# Altium project Altium_project_DPRS10A16V.PrjPcb (part 2 of 2)

## Sheet Buck.SchDoc
size A3; SheetNumber: 2; SheetTotal: 2
Used 2 times, as channels U_Buck, U_Buck. Parts and nets are listed once, with the designators drawn on the sheet.
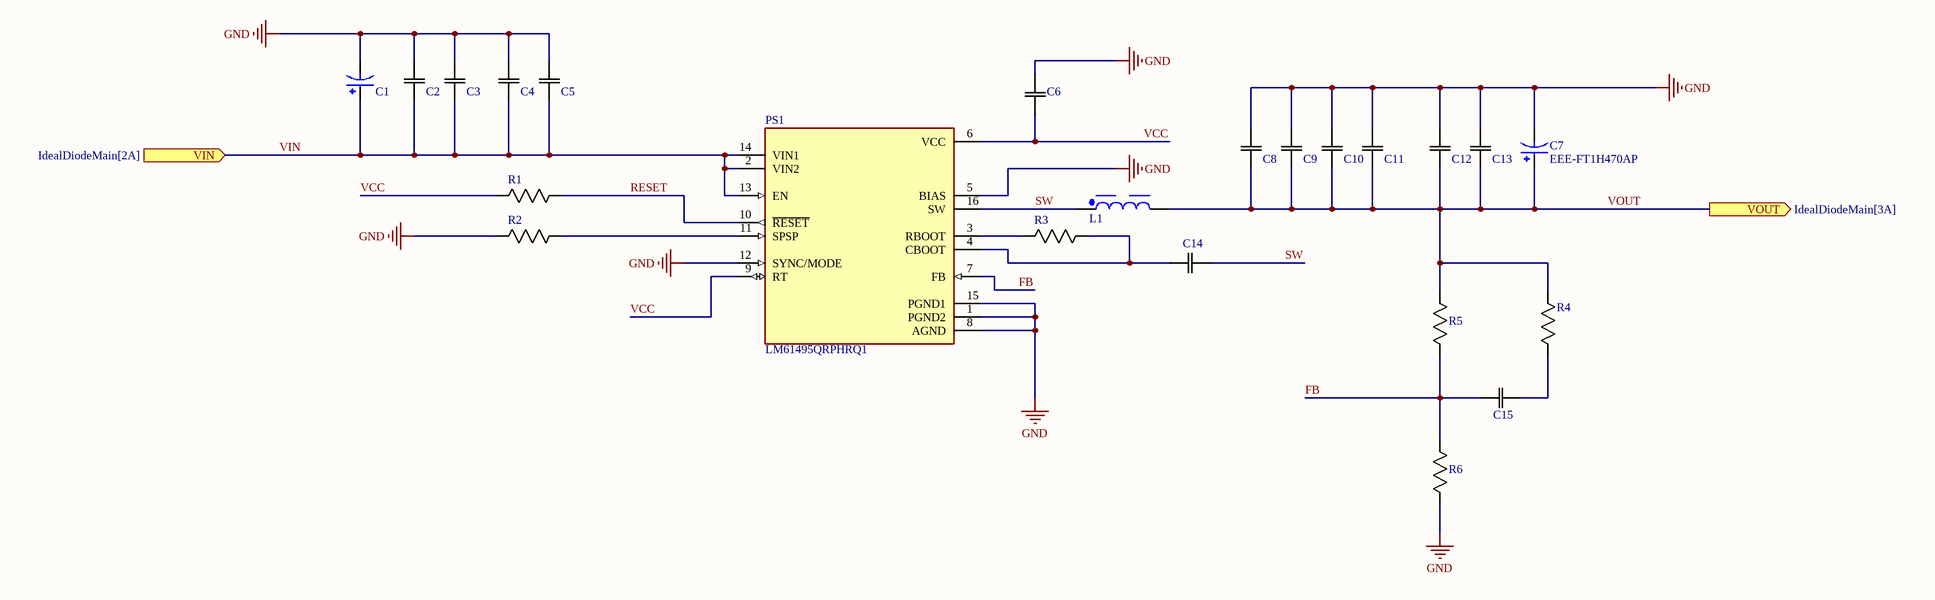
[diagram p1: Buck.SchDoc]

### Parts
C1  EEE-FT1H470AP  [CAP_EEEFT1H470AP]  (value not drawn)
C2  C3216X7R1H106K160AC  [CAP_1206]  (value not drawn)
C3  C3216X7R1H106K160AC  [CAP_1206]  (value not drawn)
C4  CGA3E3X7R1H474K080AB  [CAP_0603]  (value not drawn)
C5  CGA3E3X7R1H474K080AB  [CAP_0603]  (value not drawn)
C6  TMK107B7105KA-T  [CAP_0603]  (value not drawn)
C7  EEE-FT1H470AP  [CAP_EEEFT1H470AP]
C8  C3216X5R1V226M160AC  [CAP_1206]  (value not drawn)
C9  C3216X5R1V226M160AC  [CAP_1206]  (value not drawn)
C10  C3216X5R1V226M160AC  [CAP_1206]  (value not drawn)
C11  C3216X5R1V226M160AC  [CAP_1206]  (value not drawn)
C12  CGA4J1X7R1V225K125AE  [CAP_0805]  (value not drawn)
C13  CGA4J1X7R1V225K125AE  [CAP_0805]  (value not drawn)
C14  CGA2B3X7R1H104K050BB  [CAP_0402]  (value not drawn)
C15  C0402C100K5RACTU  [CAP_0402]  (value not drawn)
L1  3.5uH, 11A  [WE-PD_1210]  (value not drawn)
PS1  LM61495QRPHRQ1  [CONV_LM61495QRPHRQ1]
R1  RC0402JR-07100KL  [RES_0402]  (value not drawn)
R2  RC0402FR-1311K8L  [RES_0402]  (value not drawn)
R3  ERJ-2GE0R00X  [RES_0402]  (value not drawn)
R4  RK73H1ETTP4991F  [RES_0402]  (value not drawn)
R5  RC0402JR-07100KL  [RES_0402]  (value not drawn)
R6  RK73H1ETTP6651F  [RES_0402]  (value not drawn)

### Ports
VIN (in, see IdealDiodeMain[2A]), VOUT (out, see IdealDiodeMain[3A])

### Nets
GND: C1.2 C2.1 C3.1 C4.1 C5.1 C6.2 C7.2 C8.2 C9.2 C10.2 C11.2 C12.1 C13.1 PS1.1(PGND2) PS1.5(BIAS) PS1.8(AGND) PS1.12(SYNC/MODE) PS1.15(PGND1) R2.2 R6.2
FB: C15.2 PS1.7(FB) R5.2 R6.1
RESET: PS1.10(~{RESET}) R1.1
SW: C14.2 L1.1 PS1.16(SW)
VCC: C6.1 PS1.6(VCC) PS1.9(RT) R1.2
VIN: C1.1 C2.2 C3.2 C4.2 C5.2 PS1.2(VIN2) PS1.13(EN) PS1.14(VIN1) ; port VIN
VOUT: C7.1 C8.1 C9.1 C10.1 C11.1 C12.2 C13.2 L1.2 R4.1 R5.1 ; port VOUT
NetC14_1: C14.1 PS1.4(CBOOT) R3.1
NetC15_1: C15.1 R4.2
NetPS1_3: PS1.3(RBOOT) R3.2
NetPS1_11: PS1.11(SPSP) R2.1

### Channels
U_Buck: designators end in B; ports VIN=VIN VOUT=VOUT
U_Buck: designators end in A; ports VIN=VIN VOUT=VOUT

### Library data of the parts
C1 C7 = EEEFT1H470AP: 47ÂµF 50V Aluminum Electrolytic Capacitors Radial, Can - SMD 680mOhm @ 100kHz 2000 Hrs @ 105Â°C; MF: Panasonic; SnapEDA_Link: https://www.snapeda.com/parts/EEEFT1H470AP/Panasonic/view-part/?ref=snap; Package: RADIAL-2 Panasonic; Value: *; MP: EEEFT1H470AP; Check_prices: https://www.snapeda.com/parts/EEEFT1H470AP/Panasonic/view-part/?ref=eda
C2 C3 = C3216X7R1H106K160AC: 10 µF ±10% 50V Ceramic Capacitor X7R 1206 (3216 Metric); Manufacturer_Name: TDK; Copyright: Copyright (C) 2025 Ultra Librarian. All rights reserved.; Manufacturer_Part_Number: C3216X7R1H106K160AC
C4 C5 = CGA3E3X7R1H474K080AB: 0.47 µF ±10% 50V Ceramic Capacitor X7R 0603 (1608 Metric); Manufacturer_Name: TDK; Copyright: Copyright (C) 2025 Ultra Librarian. All rights reserved.; Manufacturer_Part_Number: CGA3E3X7R1H474K080AB
C6 = TMK107B7105KA-T: 0603 1 uF 25 V ±10% Tolerance X7R SMT Multilayer Ceramic Capacitor; Manufacturer: Taiyo Yuden; Value: 1µF; Voltage Rating: 25V; Supplier: DigiKey; Supplier Part Number: 587-2984-1-ND; Manufacturer Part Number: TMK107B7105KA-T; RoHS: Compliant; Category: Ceramic Capacitors; Stock: 501480; Pricing: 1=0.08, 10=0.010 (USD); Case/Package: 0603; Case Code (Imperial): 0603; Case Code (Metric): 1608; Composition: Ceramic; Contact Plating: Tin; Depth: 800µm; Dielectric: X7R; Dielectric Material: Ceramic; Halogen Free: Halogen Free; Height: 800µm; Length: 1.6mm; Lifecycle Status: Production; Material: Ceramic; Max Length: 1.7mm; Max Operating Temperature: 125°C; Max Thickness: 900µm; Max Width: 900µm; Min Length: 1.5mm; Min Operating Temperature: -55°C; Min Thickness: 700µm; Min Width: 700µm; Mounting Technology: Surface Mount; Pins: 2; Number of Terminals: 2; Radiation Hardening: No; REACH SVHC: Yes; Termination: SMD/SMT; Thickness: 889µm; Tolerance: 10%; Voltage Rating (DC): 25V; Width: 800µm; ComponentLink1URL: https://datasheet.octopart.com:443/TMK107B7105KA-T-Taiyo-Yuden-datasheet-181961942.pdf?src-supplier=Newark; ComponentLink1Description: https://datasheet.octopart.com:443/TMK107B7105KA-T-Taiyo-Yuden-datasheet-181961942.pdf?src-supplier=Newark; ComponentLink2URL: https://datasheet.octopart.com:443/TMK107B7105KA-T-Taiyo-Yuden-datasheet-23715841.pdf?src-supplier=Newark; ComponentLink2Description: https://datasheet.octopart.com:443/TMK107B7105KA-T-Taiyo-Yuden-datasheet-23715841.pdf?src-supplier=Newark; ComponentLink3URL: https://datasheet.octopart.com:443/TMK107B7105KA-T-Taiyo-Yuden-datasheet-151625811.pdf?src-supplier=Newark; ComponentLink3Description: https://datasheet.octopart.com:443/TMK107B7105KA-T-Taiyo-Yuden-datasheet-151625811.pdf?src-supplier=Newark; ComponentLink4URL: https://datasheet.octopart.com:443/TMK107B7105KA-T-Taiyo-Yuden-datasheet-154810059.pdf?src-supplier=Master+Electronics; ComponentLink4Description: https://datasheet.octopart.com:443/TMK107B7105KA-T-Taiyo-Yuden-datasheet-154810059.pdf?src-supplier=Master+Electronics; ComponentLink5URL: https://datasheet.octopart.com/TMK107B7105KA-T-Taiyo-Yuden-datasheet-13697991.pdf; ComponentLink5Description: https://datasheet.octopart.com/TMK107B7105KA-T-Taiyo-Yuden-datasheet-13697991.pdf; ComponentLink6URL: https://datasheet.octopart.com:443/TMK107B7105KA-T-Taiyo-Yuden-datasheet-10851928.pdf?src-supplier=element14+APAC; ComponentLink6Description: https://datasheet.octopart.com:443/TMK107B7105KA-T-Taiyo-Yuden-datasheet-10851928.pdf?src-supplier=element14+APAC; ComponentLink7URL: https://datasheet.octopart.com:443/TMK107B7105KA-T-Taiyo-Yuden-datasheet-138738940.pdf?src-supplier=Taiyo+Yuden+SCT; ComponentLink7Description: https://datasheet.octopart.com:443/TMK107B7105KA-T-Taiyo-Yuden-datasheet-138738940.pdf?src-supplier=Taiyo+Yuden+SCT; ComponentLink8URL: https://datasheet.octopart.com:443/TMK107B7105KA-T-Taiyo-Yuden-datasheet-99784819.pdf?src-supplier=Future+Electronics; ComponentLink8Description: https://datasheet.octopart.com:443/TMK107B7105KA-T-Taiyo-Yuden-datasheet-99784819.pdf?src-supplier=Future+Electronics; ComponentLink9URL: https://datasheet.octopart.com:443/TMK107B7105KA-T-Taiyo-Yuden-datasheet-99833418.pdf?src-supplier=Future+Electronics; ComponentLink9Description: https://datasheet.octopart.com:443/TMK107B7105KA-T-Taiyo-Yuden-datasheet-99833418.pdf?src-supplier=Future+Electronics; ComponentLink10URL: https://datasheet.octopart.com:443/TMK107B7105KA-T-Taiyo-Yuden-datasheet-62109605.pdf?src-supplier=Electro+Sonic; ComponentLink10Description: https://datasheet.octopart.com:443/TMK107B7105KA-T-Taiyo-Yuden-datasheet-62109605.pdf?src-supplier=Electro+Sonic; ComponentLink11URL: https://datasheet.octopart.com:443/TMK107B7105KA-T-Taiyo-Yuden-datasheet-41181867.pdf?src-supplier=Electro+Sonic; ComponentLink11Description: https://datasheet.octopart.com:443/TMK107B7105KA-T-Taiyo-Yuden-datasheet-41181867.pdf?src-supplier=Electro+Sonic
C8-C11 = C3216X5R1V226M160AC: Multilayer Ceramic Capacitors MLCC – SMD/SMT; TDK; C3216X5R1V226M160AC; 22 µF; 1206; 35 V; 35 V; Manufacturer Lifecycle Status: PRODUCTION; Value: 22µF; Dielectric: X5R; Tolerance: 20%; Voltage: 35V; Supplier: DigiKey; Supplier Part Number: 445-8045-1-ND; Manufacturer: TDK; Manufacturer Part Number: C3216X5R1V226M160AC; RoHS: Compliant; Category: Ceramic Capacitors; Stock: 260699; Pricing: 1=0.81, 10=0.51, 50=0.3898, 100=0.3371, 500=0.29562, 1000=0.27671 (USD); Case/Package: 1206; Case Code (Imperial): 1206; Case Code (Metric): 3216; China RoHS: Compliant; Composition: Ceramic; Depth: 1.6mm; Dielectric Material: Ceramic; Height: 1.6mm; Lead Free: Lead Free; Length: 3.2mm; Lifecycle Status: Production; Material: Ceramic; Max Length: 3.4mm; Max Operating Temperature: 85°C; Max Width: 1.8mm; Min Length: 3mm; Min Operating Temperature: -55°C; Min Width: 1.4mm; Mounting Technology: Surface Mount; Number of Terminals: 2; Radiation Hardening: No; REACH SVHC: Yes; Schedule B: 8532240020, 8532240020|8532240020|8532240020|8532240020|8532240020|8532240020|8532240020|8532240020|8532240020|8532240020|8532240020|8532240020|8532240020|8532240020|8532240020|8532240020|8532240020|8532240020|8532240020|8532240020|8532240020|8532240020|8532240020|85; Termination: SMD/SMT; Thickness: 1.6mm; Voltage Rating: 35V; Voltage Rating (DC): 35V; Weight: 16.187578mg; Width: 1.6mm; ComponentLink1URL: https://datasheet.octopart.com:443/C3216X5R1V226M160AC-TDK-datasheet-175423548.pdf?src-supplier=TME; ComponentLink1Description: https://datasheet.octopart.com:443/C3216X5R1V226M160AC-TDK-datasheet-175423548.pdf?src-supplier=TME; ComponentLink2URL: https://datasheet.octopart.com:443/C3216X5R1V226M160AC-TDK-datasheet-182135025.pdf?src-supplier=TME; ComponentLink2Description: https://datasheet.octopart.com:443/C3216X5R1V226M160AC-TDK-datasheet-182135025.pdf?src-supplier=TME; ComponentLink3URL: https://datasheet.octopart.com:443/C3216X5R1V226M160AC-TDK-datasheet-159617022.pdf?src-supplier=TME; ComponentLink3Description: https://datasheet.octopart.com:443/C3216X5R1V226M160AC-TDK-datasheet-159617022.pdf?src-supplier=TME; ComponentLink4URL: https://datasheet.octopart.com/C3216X5R1V226M160AC-TDK-datasheet-41194876.pdf; ComponentLink4Description: https://datasheet.octopart.com/C3216X5R1V226M160AC-TDK-datasheet-41194876.pdf; ComponentLink5URL: https://datasheet.octopart.com:443/C3216X5R1V226M160AC-TDK-datasheet-151546523.pdf?src-supplier=ODG+(Origin+Data+Global); ComponentLink5Description: https://datasheet.octopart.com:443/C3216X5R1V226M160AC-TDK-datasheet-151546523.pdf?src-supplier=ODG+(Origin+Data+Global); ComponentLink6URL: https://datasheet.octopart.com:443/C3216X5R1V226M160AC-TDK-datasheet-154546117.pdf?src-supplier=Newark; ComponentLink6Description: https://datasheet.octopart.com:443/C3216X5R1V226M160AC-TDK-datasheet-154546117.pdf?src-supplier=Newark; ComponentLink7URL: https://datasheet.octopart.com:443/C3216X5R1V226M160AC-TDK-datasheet-82475248.pdf?src-supplier=Newark; ComponentLink7Description: https://datasheet.octopart.com:443/C3216X5R1V226M160AC-TDK-datasheet-82475248.pdf?src-supplier=Newark; ComponentLink8URL: https://datasheet.octopart.com:443/C3216X5R1V226M160AC-TDK-datasheet-13444418.pdf?src-supplier=Newark; ComponentLink8Description: https://datasheet.octopart.com:443/C3216X5R1V226M160AC-TDK-datasheet-13444418.pdf?src-supplier=Newark; ComponentLink9URL: https://datasheet.octopart.com:443/C3216X5R1V226M160AC-TDK-datasheet-23766614.pdf?src-supplier=Newark; ComponentLink9Description: https://datasheet.octopart.com:443/C3216X5R1V226M160AC-TDK-datasheet-23766614.pdf?src-supplier=Newark; ComponentLink10URL: https://datasheet.octopart.com:443/C3216X5R1V226M160AC-TDK-datasheet-41169347.pdf?src-supplier=element14+APAC; ComponentLink10Description: https://datasheet.octopart.com:443/C3216X5R1V226M160AC-TDK-datasheet-41169347.pdf?src-supplier=element14+APAC
C12 C13 = CGA4J1X7R1V225K125AE: Cap Ceramic 2.2uF 35V X7R 10% Pad SMD 0805 Soft Termination 125C Automotive T/R; Manufacturer: TDK; Manufacturer Lifecycle Status: PRODUCTION; Value: 2.2µF; Supplier: DigiKey; Supplier Part Number: 445-8787-1-ND; Manufacturer Part Number: CGA4J1X7R1V225K125AE; RoHS: Compliant; Category: Ceramic Capacitors; Stock: 669506; Pricing: 1=0.66, 10=0.395, 50=0.301, 100=0.2616, 500=0.23234, 1000=0.21653 (USD); Case/Package: 0805; Case Code (Imperial): 0805; Case Code (Metric): 2012; China RoHS: Compliant; Depth: 1.25mm; Dielectric: X7R; Dielectric Material: Ceramic; Features: Soft Termination; Height: 1.25mm; Length: 2mm; Lifecycle Status: Production; Material: Ceramic; Max Length: 2.45mm; Max Operating Temperature: 125°C; Max Width: 1.5mm; Min Length: 1.8mm; Min Operating Temperature: -55°C; Min Width: 1.05mm; Mounting Technology: Surface Mount; Number of Terminals: 2; Ratings: AEC-Q200; REACH SVHC: Yes; Schedule B: 8532240020, 8532240020|8532240020|8532240020|8532240020|8532240020; Termination: SMD/SMT; Thickness: 1.4478mm; Tolerance: 10%; Voltage Rating: 35V; Voltage Rating (DC): 35V; Weight: 5.499807mg; Width: 1.25mm; ComponentLink1URL: https://datasheet.octopart.com:443/CGA4J1X7R1V225K125AE-TDK-datasheet-181961979.pdf?src-supplier=IHS; ComponentLink1Description: https://datasheet.octopart.com:443/CGA4J1X7R1V225K125AE-TDK-datasheet-181961979.pdf?src-supplier=IHS; ComponentLink2URL: https://datasheet.octopart.com:443/CGA4J1X7R1V225K125AE-TDK-datasheet-57863114.pdf?src-supplier=Newark; ComponentLink2Description: https://datasheet.octopart.com:443/CGA4J1X7R1V225K125AE-TDK-datasheet-57863114.pdf?src-supplier=Newark; ComponentLink3URL: https://datasheet.octopart.com:443/CGA4J1X7R1V225K125AE-TDK-datasheet-82475251.pdf?src-supplier=Newark; ComponentLink3Description: https://datasheet.octopart.com:443/CGA4J1X7R1V225K125AE-TDK-datasheet-82475251.pdf?src-supplier=Newark; ComponentLink4URL: https://datasheet.octopart.com:443/CGA4J1X7R1V225K125AE-TDK-datasheet-153441518.pdf?src-supplier=TDK; ComponentLink4Description: https://datasheet.octopart.com:443/CGA4J1X7R1V225K125AE-TDK-datasheet-153441518.pdf?src-supplier=TDK; ComponentLink5URL: https://datasheet.octopart.com:443/CGA4J1X7R1V225K125AE-TDK-datasheet-165583812.pdf?src-supplier=TME; ComponentLink5Description: https://datasheet.octopart.com:443/CGA4J1X7R1V225K125AE-TDK-datasheet-165583812.pdf?src-supplier=TME
C14 = CGA2B3X7R1H104K050BB: CGA Series 0402 100 nF 50 V ±10 % Tolerance X7R SMT Multilayer Ceramic Capacitor; Manufacturer: TDK; Manufacturer Lifecycle Status: PRODUCTION; Value: 100nF; Tolerance: 10%; Voltage: 50V; Supplier: DigiKey; Supplier Part Number: 445-6899-1-ND; Manufacturer Part Number: CGA2B3X7R1H104K050BB; RoHS: Compliant; Category: Ceramic Capacitors; Stock: 4086193; Pricing: 1=0.13, 10=0.072, 50=0.05, 100=0.0434, 500=0.03172, 1000=0.02889, 2500=0.0253, 5000=0.02314 (USD); Case/Package: 0402; Case Code (Imperial): 0402; Case Code (Metric): 1005; China RoHS: Compliant; Composition: Ceramic; Depth: 500µm; Dielectric: X7R; Dielectric Material: Ceramic; Height: 500µm; Lead Free: Lead Free; Length: 1mm; Lifecycle Status: Production; Material: Ceramic; Max Length: 1.05mm; Max Operating Temperature: 125°C; Max Width: 550µm; Min Length: 950µm; Min Operating Temperature: -55°C; Min Width: 450µm; Mounting Technology: Surface Mount; Number of Terminals: 2; Ratings: AEC-Q200; REACH SVHC: Yes; Schedule B: 8532240020, 8532240020|8532240020|8532240020|8532240020|8532240020|8532240020|8532240020|8532240020|8532240020|8532240020|8532240020|8532240020|8532240020|8532240020|8532240020|8532240020|8532240020|8532240020|8532240020|8532240020|8532240020|8532240020|8532240020|85; Termination: SMD/SMT; Thickness: 558.8µm; Voltage Rating: 50V; Voltage Rating (DC): 50V; Weight: 652.039032µg; Width: 500µm; ComponentLink1URL: https://datasheet.octopart.com:443/CGA2B3X7R1H104K050BB-TDK-datasheet-165583812.pdf?src-supplier=IHS; ComponentLink1Description: https://datasheet.octopart.com:443/CGA2B3X7R1H104K050BB-TDK-datasheet-165583812.pdf?src-supplier=IHS; ComponentLink2URL: https://datasheet.octopart.com:443/CGA2B3X7R1H104K050BB-TDK-datasheet-138890726.pdf?src-supplier=Upverter; ComponentLink2Description: https://datasheet.octopart.com:443/CGA2B3X7R1H104K050BB-TDK-datasheet-138890726.pdf?src-supplier=Upverter; ComponentLink3URL: https://datasheet.octopart.com:443/CGA2B3X7R1H104K050BB-TDK-datasheet-151546526.pdf?src-supplier=ODG+(Origin+Data+Global); ComponentLink3Description: https://datasheet.octopart.com:443/CGA2B3X7R1H104K050BB-TDK-datasheet-151546526.pdf?src-supplier=ODG+(Origin+Data+Global); ComponentLink4URL: https://datasheet.octopart.com:443/CGA2B3X7R1H104K050BB-TDK-datasheet-159510193.pdf?src-supplier=Newark; ComponentLink4Description: https://datasheet.octopart.com:443/CGA2B3X7R1H104K050BB-TDK-datasheet-159510193.pdf?src-supplier=Newark; ComponentLink5URL: https://datasheet.octopart.com:443/CGA2B3X7R1H104K050BB-TDK-datasheet-21217900.pdf?src-supplier=Newark; ComponentLink5Description: https://datasheet.octopart.com:443/CGA2B3X7R1H104K050BB-TDK-datasheet-21217900.pdf?src-supplier=Newark; ComponentLink6URL: https://datasheet.octopart.com:443/CGA2B3X7R1H104K050BB-TDK-datasheet-43366117.pdf?src-supplier=Newark; ComponentLink6Description: https://datasheet.octopart.com:443/CGA2B3X7R1H104K050BB-TDK-datasheet-43366117.pdf?src-supplier=Newark; ComponentLink7URL: https://datasheet.octopart.com:443/CGA2B3X7R1H104K050BB-TDK-datasheet-33009218.pdf?src-supplier=Newark; ComponentLink7Description: https://datasheet.octopart.com:443/CGA2B3X7R1H104K050BB-TDK-datasheet-33009218.pdf?src-supplier=Newark; ComponentLink8URL: https://datasheet.octopart.com:443/CGA2B3X7R1H104K050BB-TDK-datasheet-13376850.pdf?src-supplier=Newark; ComponentLink8Description: https://datasheet.octopart.com:443/CGA2B3X7R1H104K050BB-TDK-datasheet-13376850.pdf?src-supplier=Newark; ComponentLink9URL: https://datasheet.octopart.com:443/CGA2B3X7R1H104K050BB-TDK-datasheet-12956201.pdf?src-supplier=Newark; ComponentLink9Description: https://datasheet.octopart.com:443/CGA2B3X7R1H104K050BB-TDK-datasheet-12956201.pdf?src-supplier=Newark; ComponentLink10URL: https://datasheet.octopart.com:443/CGA2B3X7R1H104K050BB-TDK-datasheet-164882302.pdf?src-supplier=Burklin+Elektronik; ComponentLink10Description: https://datasheet.octopart.com:443/CGA2B3X7R1H104K050BB-TDK-datasheet-164882302.pdf?src-supplier=Burklin+Elektronik; ComponentLink11URL: https://datasheet.octopart.com:443/CGA2B3X7R1H104K050BB-TDK-datasheet-13234200.pdf?src-supplier=Future+Electronics; ComponentLink11Description: https://datasheet.octopart.com:443/CGA2B3X7R1H104K050BB-TDK-datasheet-13234200.pdf?src-supplier=Future+Electronics; ComponentLink12URL: https://datasheet.octopart.com:443/CGA2B3X7R1H104K050BB-TDK-datasheet-12527010.pdf?src-supplier=Future+Electronics; ComponentLink12Description: https://datasheet.octopart.com:443/CGA2B3X7R1H104K050BB-TDK-datasheet-12527010.pdf?src-supplier=Future+Electronics; ComponentLink13URL: https://datasheet.octopart.com:443/CGA2B3X7R1H104K050BB-TDK-datasheet-140571036.pdf?src-supplier=Arrow.cn; ComponentLink13Description: https://datasheet.octopart.com:443/CGA2B3X7R1H104K050BB-TDK-datasheet-140571036.pdf?src-supplier=Arrow.cn
C15 = C0402C100K5RACTU: Multilayer Ceramic Capacitors MLCC - SMD/SMT 50V 10pF X7R 0402 10%; Manufacturer: KEMET; Supplier: DigiKey; Supplier Part Number: 399-C0402C100K5RACTUCT-ND; Manufacturer Part Number: C0402C100K5RACTU; RoHS: Compliant; Category: Ceramic Capacitors; Stock: 72570; Pricing: 1=0.1, 10=0.042, 50=0.0282, 100=0.0243, 500=0.01752, 1000=0.01547, 2500=0.01322, 5000=0.01199 (USD); Value: 10pF; Case/Package: 0402; China RoHS: Compliant; Dielectric: X7R; Dielectric Material: Ceramic; Height: 500µm; Length: 1mm; Lifecycle Status: Production; Material: Ceramic; Max Operating Temperature: 125°C; Min Operating Temperature: -55°C; Mounting Technology: Surface Mount; Pins: 2; Number of Terminals: 2; REACH SVHC: Yes; Schedule B: 8532240020; Tolerance: 10%; Voltage Rating: 50V; Voltage Rating (DC): 50V; Width: 500µm; ComponentLink1URL: https://datasheet.octopart.com:443/C0402C100K5RACTU-KEMET-datasheet-178445679.pdf?src-supplier=IHS; ComponentLink1Description: https://datasheet.octopart.com:443/C0402C100K5RACTU-KEMET-datasheet-178445679.pdf?src-supplier=IHS; ComponentLink2URL: https://datasheet.octopart.com:443/C0402C100K5RACTU-KEMET-datasheet-137357759.pdf?src-supplier=Farnell; ComponentLink2Description: https://datasheet.octopart.com:443/C0402C100K5RACTU-KEMET-datasheet-137357759.pdf?src-supplier=Farnell; ComponentLink3URL: https://datasheet.octopart.com:443/C0402C100K5RACTU-KEMET-datasheet-101607523.pdf?src-supplier=Farnell; ComponentLink3Description: https://datasheet.octopart.com:443/C0402C100K5RACTU-KEMET-datasheet-101607523.pdf?src-supplier=Farnell; ComponentLink4URL: https://datasheet.octopart.com:443/C0402C100K5RACTU-KEMET-datasheet-157246124.pdf?src-supplier=Electro+Sonic; ComponentLink4Description: https://datasheet.octopart.com:443/C0402C100K5RACTU-KEMET-datasheet-157246124.pdf?src-supplier=Electro+Sonic; ComponentLink5URL: https://datasheet.octopart.com:443/C0402C100K5RACTU-KEMET-datasheet-178087912.pdf?src-supplier=Newark; ComponentLink5Description: https://datasheet.octopart.com:443/C0402C100K5RACTU-KEMET-datasheet-178087912.pdf?src-supplier=Newark; ComponentLink6URL: https://datasheet.octopart.com:443/C0402C100K5RACTU-KEMET-datasheet-188904202.pdf?src-supplier=TME; ComponentLink6Description: https://datasheet.octopart.com:443/C0402C100K5RACTU-KEMET-datasheet-188904202.pdf?src-supplier=TME; ComponentLink7URL: https://datasheet.octopart.com:443/C0402C100K5RACTU-KEMET-datasheet-158241862.pdf?src-supplier=TME; ComponentLink7Description: https://datasheet.octopart.com:443/C0402C100K5RACTU-KEMET-datasheet-158241862.pdf?src-supplier=TME; ComponentLink8URL: https://datasheet.octopart.com:443/C0402C100K5RACTU-KEMET-datasheet-147336158.pdf?src-supplier=Ciiva; ComponentLink8Description: https://datasheet.octopart.com:443/C0402C100K5RACTU-KEMET-datasheet-147336158.pdf?src-supplier=Ciiva; ComponentLink9URL: https://datasheet.octopart.com/C0402C100K5RACTU-KEMET-datasheet-84169754.pdf; ComponentLink9Description: https://datasheet.octopart.com/C0402C100K5RACTU-KEMET-datasheet-84169754.pdf
L1 = 7447709003: WE-PD SMT Power Inductor, size 1210, 3.5uH, 11A, 9mOhm; Manufacturer: Wurth Elektronik; Case/Size Code: 1210; DC Resistance: 6mOhm; Saturation Current: 16.5A; Self Resonant Frequency: 45MHz; Type: Standard; Manufacturer Part Number: 7447709003; Category: Power Inductors; Match Code: WE-PD; ComponentLink1Description: Website Link; ComponentLink1URL: https://www.we-online.com/redexpert/article/7447709003?ad; ComponentLink2Description: Datasheet Link; ComponentLink2URL: https://www.we-online.com/redexpert/spec/7447709003?ad; Mount: Surface Mount; Operating Temperature Max: 125°C; Operating Temperature Min: -40°C; Packaging: Tape and Reel; Length: 12mm; Width: 12mm; Height: 10mm; DC Resistance Max: 9mOhm; Inductance: 3.5uH; Rated Current: 11A
PS1 = LM61495QRPHRQ1: 10-A automotive buck converter optimized for power density and low EMI; MF: Texas Instruments; SnapEDA_Link: https://www.snapeda.com/parts/LM61495QRPHRQ1/Texas+Instruments/view-part/?ref=snap; Package: PowerVFQFN-16 Texas Instruments; Value: *; MP: LM61495QRPHRQ1; Check_prices: https://www.snapeda.com/parts/LM61495QRPHRQ1/Texas+Instruments/view-part/?ref=eda
R1 R5 = RC0402JR-07100KL: 62.5mW Thick Film Resistors 50V ±100ppm/℃ ±5% 100kΩ 0402 Chip Resistor - Surface Mount ROHS; Manufacturer: Yageo Group; Max Power Dissipation: 63mW; Temperature Coefficient: 100ppm/°C; Supplier: DigiKey; Supplier Part Number: 311-100KJRCT-ND; Manufacturer Part Number: RC0402JR-07100KL; RoHS: Compliant; Category: Chip SMD Resistors; Stock: 4354128; Pricing: 1=0.1, 10=0.006, 25=0.0052, 50=0.004, 100=0.0036, 250=0.00284 (USD); Case/Package: 0402; Case Code (Imperial): 0402; China RoHS: Non-Compliant; Composition: Thick Film; Depth: 500µm; Features: Moisture Resistant; Height: 350µm; Lead Free: Lead Free; Length: 1mm; Lifecycle Status: Production; Max Operating Temperature: 155°C; Military Standard: Not; Min Operating Temperature: -55°C; Mounting Technology: Surface Mount; Pins: 2; Number of Terminals: 2; Number of Terminations: 2; Packaging: Tape & Reel; Power Dissipation: 62.5mW; Power Rating: 63mW; REACH SVHC: Yes; Value: 100kΩ; Schedule B: 8533210045, 8533210045|8533210045, 8533210045|8533210045|8533210045, 8533210045|8533210045|8533210045|8533210045; Termination: SMD/SMT; Tolerance: 5%; Voltage Rating: 50V; Voltage Rating (AC): 50V; Voltage Rating (DC): 50V; Width: 500µm; Working Voltage: 50V; ComponentLink1URL: https://datasheet.octopart.com:443/RC0402JR-07100KL-Yageo-datasheet-175887523.pdf?src-supplier=Newark; ComponentLink1Description: https://datasheet.octopart.com:443/RC0402JR-07100KL-Yageo-datasheet-175887523.pdf?src-supplier=Newark; ComponentLink2URL: https://datasheet.octopart.com:443/RC0402JR-07100KL-Yageo-datasheet-10408619.pdf?src-supplier=Newark; ComponentLink2Description: https://datasheet.octopart.com:443/RC0402JR-07100KL-Yageo-datasheet-10408619.pdf?src-supplier=Newark; ComponentLink3URL: https://datasheet.octopart.com:443/RC0402JR-07100KL-Yageo-datasheet-8324527.pdf?src-supplier=Newark; ComponentLink3Description: https://datasheet.octopart.com:443/RC0402JR-07100KL-Yageo-datasheet-8324527.pdf?src-supplier=Newark; ComponentLink4URL: https://datasheet.octopart.com:443/RC0402JR-07100KL-Yageo-datasheet-141265859.pdf?src-supplier=Upverter; ComponentLink4Description: https://datasheet.octopart.com:443/RC0402JR-07100KL-Yageo-datasheet-141265859.pdf?src-supplier=Upverter; ComponentLink5URL: https://sigma.octopart.com:443/138820526/technical_drawing/Yageo-RC0402JR-07100KL.pdf?src-supplier=Upverter; ComponentLink5Description: https://sigma.octopart.com:443/138820526/technical_drawing/Yageo-RC0402JR-07100KL.pdf?src-supplier=Upverter; ComponentLink6URL: https://datasheet.octopart.com:443/RC0402JR-07100KL-Yageo-datasheet-98239111.pdf?src-supplier=Upverter; ComponentLink6Description: https://datasheet.octopart.com:443/RC0402JR-07100KL-Yageo-datasheet-98239111.pdf?src-supplier=Upverter; ComponentLink7URL: https://datasheet.octopart.com:443/RC0402JR-07100KL-Yageo-datasheet-141435361.pdf?src-supplier=Upverter; ComponentLink7Description: https://datasheet.octopart.com:443/RC0402JR-07100KL-Yageo-datasheet-141435361.pdf?src-supplier=Upverter; ComponentLink8URL: https://datasheet.octopart.com:443/RC0402JR-07100KL-Yageo-datasheet-62067350.pdf?src-supplier=element14+APAC; ComponentLink8Description: https://datasheet.octopart.com:443/RC0402JR-07100KL-Yageo-datasheet-62067350.pdf?src-supplier=element14+APAC; ComponentLink9URL: https://datasheet.octopart.com:443/RC0402JR-07100KL-Yageo-Group-datasheet-176638170.pdf?src-supplier=Farnell; ComponentLink9Description: https://datasheet.octopart.com:443/RC0402JR-07100KL-Yageo-Group-datasheet-176638170.pdf?src-supplier=Farnell; ComponentLink10URL: https://datasheet.octopart.com:443/RC0402JR-07100KL-Yageo-datasheet-164759695.pdf?src-supplier=Future+Electronics; ComponentLink10Description: https://datasheet.octopart.com:443/RC0402JR-07100KL-Yageo-datasheet-164759695.pdf?src-supplier=Future+Electronics; ComponentLink11URL: https://datasheet.octopart.com:443/RC0402JR-07100KL-Yageo-datasheet-137700087.pdf?src-supplier=Future+Electronics; ComponentLink11Description: https://datasheet.octopart.com:443/RC0402JR-07100KL-Yageo-datasheet-137700087.pdf?src-supplier=Future+Electronics; ComponentLink12URL: https://datasheet.octopart.com:443/RC0402JR-07100KL-Yageo-datasheet-12531192.pdf?src-supplier=Future+Electronics; ComponentLink12Description: https://datasheet.octopart.com:443/RC0402JR-07100KL-Yageo-datasheet-12531192.pdf?src-supplier=Future+Electronics; ComponentLink13URL: https://datasheet.octopart.com:443/RC0402JR-07100KL-Yageo-datasheet-505231.pdf?src-supplier=Future+Electronics; ComponentLink13Description: https://datasheet.octopart.com:443/RC0402JR-07100KL-Yageo-datasheet-505231.pdf?src-supplier=Future+Electronics; ComponentLink14URL: https://datasheet.octopart.com:443/RC0402JR-07100KL-Yageo-datasheet-148775077.pdf?src-supplier=TME; ComponentLink14Description: https://datasheet.octopart.com:443/RC0402JR-07100KL-Yageo-datasheet-148775077.pdf?src-supplier=TME; ComponentLink15URL: https://datasheet.octopart.com/RC0402JR-07100KL-Yageo-datasheet-73766026.pdf; ComponentLink15Description: https://datasheet.octopart.com/RC0402JR-07100KL-Yageo-datasheet-73766026.pdf; ComponentLink16URL: https://datasheet.octopart.com:443/RC0402JR-07100KL-Yageo-datasheet-8329306.pdf?src-supplier=element14; ComponentLink16Description: https://datasheet.octopart.com:443/RC0402JR-07100KL-Yageo-datasheet-8329306.pdf?src-supplier=element14; ComponentLink17URL: http://sigma.octopart.com:80/rohs_statement/Yageo-company-2.pdf?src-supplier=Compliance+Statements; ComponentLink17Description: http://sigma.octopart.com:80/rohs_statement/Yageo-company-2.pdf?src-supplier=Compliance+Statements; ComponentLink18URL: http://sigma.octopart.com:80/conflict_mineral_statement/Yageo-company-3.pdf?src-supplier=Compliance+Statements; ComponentLink18Description: http://sigma.octopart.com:80/conflict_mineral_statement/Yageo-company-3.pdf?src-supplier=Compliance+Statements
R2 = RC0402FR-1311K8L: Res Thick Film 0402 11.8K Ohm 1% 0.063W(1/16W) 100ppm/C Pad SMD T/R; Manufacturer: Yageo Group; Power Dissipation: 62.5mW; Value: 11.8kΩ; Temperature Coefficient: 100ppm/°C; Working Voltage: 50V; Supplier: DigiKey; Supplier Part Number: 13-RC0402FR-1311K8LCT-ND; Manufacturer Part Number: RC0402FR-1311K8L; RoHS: Compliant; Category: Chip SMD Resistors; Stock: 194853; Pricing: 1=0.1, 10=0.02, 25=0.014, 50=0.0112, 100=0.009, 250=0.00688, 500=0.00566, 1000=0.00474, 5000=0.00328 (USD); Case/Package: 0402; China RoHS: Non-Compliant; Composition: Thick Film; Contact Plating: Tin; Height: 350µm; Lifecycle Status: Production; Max Operating Temperature: 155°C; Min Operating Temperature: -55°C; Mounting Technology: Surface Mount; Number of Terminals: 2; Packaging: Tape & Reel; REACH SVHC: Yes; Tolerance: 1%; Width: 500µm; ComponentLink1URL: https://datasheet.octopart.com:443/RC0402FR-1311K8L-Yageo-datasheet-175887523.pdf?src-supplier=IHS; ComponentLink1Description: https://datasheet.octopart.com:443/RC0402FR-1311K8L-Yageo-datasheet-175887523.pdf?src-supplier=IHS; ComponentLink2URL: https://datasheet.octopart.com:443/RC0402FR-1311K8L-Yageo-datasheet-164759695.pdf?src-supplier=Future+Electronics; ComponentLink2Description: https://datasheet.octopart.com:443/RC0402FR-1311K8L-Yageo-datasheet-164759695.pdf?src-supplier=Future+Electronics; ComponentLink3URL: https://datasheet.octopart.com:443/RC0402FR-1311K8L-Yageo-datasheet-141265859.pdf?src-supplier=Future+Electronics; ComponentLink3Description: https://datasheet.octopart.com:443/RC0402FR-1311K8L-Yageo-datasheet-141265859.pdf?src-supplier=Future+Electronics; ComponentLink4URL: https://datasheet.octopart.com/RC0402FR-1311K8L-Yageo-datasheet-73766026.pdf; ComponentLink4Description: https://datasheet.octopart.com/RC0402FR-1311K8L-Yageo-datasheet-73766026.pdf; ComponentLink5URL: https://datasheet.octopart.com:443/RC0402FR-1311K8L-Yageo-datasheet-10408619.pdf?src-supplier=_legacy+Avnet; ComponentLink5Description: https://datasheet.octopart.com:443/RC0402FR-1311K8L-Yageo-datasheet-10408619.pdf?src-supplier=_legacy+Avnet; ComponentLink6URL: http://sigma.octopart.com:80/rohs_statement/Yageo-company-2.pdf?src-supplier=Compliance+Statements; ComponentLink6Description: http://sigma.octopart.com:80/rohs_statement/Yageo-company-2.pdf?src-supplier=Compliance+Statements; ComponentLink7URL: http://sigma.octopart.com:80/conflict_mineral_statement/Yageo-company-3.pdf?src-supplier=Compliance+Statements; ComponentLink7Description: http://sigma.octopart.com:80/conflict_mineral_statement/Yageo-company-3.pdf?src-supplier=Compliance+Statements
R3 = ERJ-2GE0R00X: Zero Ohm Resistor, Thick Film, 100 mW, 1 A, Surface Mount, 0402 [1005 Metric]; Manufacturer: Panasonic; Max Power Dissipation: 100mW; Value: 0Ω; Tolerance: 5%; Voltage Rating: 50V; Supplier: DigiKey; Supplier Part Number: P0.0JCT-ND; Manufacturer Part Number: ERJ-2GE0R00X; RoHS: Compliant; Category: Chip SMD Resistors; Stock: 8964543; Pricing: 1=0.1, 10=0.014, 25=0.0116, 50=0.010, 100=0.0087, 250=0.00732, 500=0.00644, 1000=0.0057, 5000=0.00436 (USD); Case/Package: 0402; Case Code (Imperial): 0402; China RoHS: Non-Compliant; Composition: Thick Film; Contact Plating: Tin; Depth: 500µm; Features: Automotive AEC-Q200; Height: 350µm; Lead Free: Lead Free; Length: 1mm; Lifecycle Status: Production; Max Operating Temperature: 155°C; Military Standard: Not; Min Operating Temperature: -55°C; Mounting Technology: Surface Mount; Pins: 2; Number of Terminals: 2; Number of Terminations: 2; Power Dissipation: 100mW; Power Rating: 100mW; Radiation Hardening: No; REACH SVHC: Yes; Termination: SMD/SMT; Voltage Rating (DC): 50V; Width: 500µm; ComponentLink1URL: https://sigma.octopart.com:443/138766958/technical_drawing/Panasonic-ERJ-2GE0R00X.pdf?src-supplier=Upverter; ComponentLink1Description: https://sigma.octopart.com:443/138766958/technical_drawing/Panasonic-ERJ-2GE0R00X.pdf?src-supplier=Upverter; ComponentLink2URL: https://datasheet.octopart.com:443/ERJ-2GE0R00X-Panasonic-datasheet-61114972.pdf?src-supplier=Future+Electronics; ComponentLink2Description: https://datasheet.octopart.com:443/ERJ-2GE0R00X-Panasonic-datasheet-61114972.pdf?src-supplier=Future+Electronics; ComponentLink3URL: https://datasheet.octopart.com:443/ERJ-2GE0R00X-Panasonic-datasheet-5314550.pdf?src-supplier=Future+Electronics; ComponentLink3Description: https://datasheet.octopart.com:443/ERJ-2GE0R00X-Panasonic-datasheet-5314550.pdf?src-supplier=Future+Electronics; ComponentLink4URL: https://datasheet.octopart.com:443/ERJ-2GE0R00X-Panasonic-datasheet-13266872.pdf?src-supplier=Newark; ComponentLink4Description: https://datasheet.octopart.com:443/ERJ-2GE0R00X-Panasonic-datasheet-13266872.pdf?src-supplier=Newark; ComponentLink5URL: https://datasheet.octopart.com:443/ERJ-2GE0R00X-Panasonic-datasheet-136608608.pdf?src-supplier=Farnell; ComponentLink5Description: https://datasheet.octopart.com:443/ERJ-2GE0R00X-Panasonic-datasheet-136608608.pdf?src-supplier=Farnell; ComponentLink6URL: https://datasheet.octopart.com:443/ERJ-2GE0R00X-Panasonic-datasheet-10554283.pdf?src-supplier=Farnell; ComponentLink6Description: https://datasheet.octopart.com:443/ERJ-2GE0R00X-Panasonic-datasheet-10554283.pdf?src-supplier=Farnell; ComponentLink7URL: https://datasheet.octopart.com:443/ERJ-2GE0R00X-Panasonic-datasheet-5313456.pdf?src-supplier=Farnell; ComponentLink7Description: https://datasheet.octopart.com:443/ERJ-2GE0R00X-Panasonic-datasheet-5313456.pdf?src-supplier=Farnell; ComponentLink8URL: https://datasheet.octopart.com:443/ERJ-2GE0R00X-Panasonic-datasheet-147443676.pdf?src-supplier=Master+Electronics; ComponentLink8Description: https://datasheet.octopart.com:443/ERJ-2GE0R00X-Panasonic-datasheet-147443676.pdf?src-supplier=Master+Electronics; ComponentLink9URL: https://datasheet.octopart.com:443/ERJ2GE0R00X-Panasonic-datasheet-165581512.pdf?src-supplier=TME; ComponentLink9Description: https://datasheet.octopart.com:443/ERJ2GE0R00X-Panasonic-datasheet-165581512.pdf?src-supplier=TME; ComponentLink10URL: https://datasheet.octopart.com:443/ERJ-2GE0R00X-Panasonic-datasheet-11480398.pdf?src-supplier=Arrow+Electronics; ComponentLink10Description: https://datasheet.octopart.com:443/ERJ-2GE0R00X-Panasonic-datasheet-11480398.pdf?src-supplier=Arrow+Electronics; ComponentLink11URL: https://datasheet.octopart.com:443/ERJ-2GE0R00X-Panasonic-datasheet-118655.pdf?src-supplier=DigiKey; ComponentLink11Description: https://datasheet.octopart.com:443/ERJ-2GE0R00X-Panasonic-datasheet-118655.pdf?src-supplier=DigiKey; ComponentLink12URL: https://datasheet.octopart.com:443/ERJ2GE0R00X-Panasonic-datasheet-27908757.pdf?src-supplier=Electro+Sonic; ComponentLink12Description: https://datasheet.octopart.com:443/ERJ2GE0R00X-Panasonic-datasheet-27908757.pdf?src-supplier=Electro+Sonic; ComponentLink13URL: https://datasheet.octopart.com:443/ERJ-2GE0R00X-Panasonic-datasheet-37173568.pdf?src-supplier=Electro+Sonic; ComponentLink13Description: https://datasheet.octopart.com:443/ERJ-2GE0R00X-Panasonic-datasheet-37173568.pdf?src-supplier=Electro+Sonic
R4 = RK73H1ETTP4991F: Res Thick Film 0402 4.99K Ohm 1% 0.1W(1/10W) ±100ppm/C Pad SMD Automotive T/R; Manufacturer: KOA Speer; Power Dissipation: 100mW; Power Rating: 63mW; Value: 4.99kΩ; Temperature Coefficient: 100ppm/°C; Voltage Rating: 50V; Working Voltage: 75V; Supplier: DigiKey; Supplier Part Number: 2019-RK73H1ETTP4991FCT-ND; Manufacturer Part Number: RK73H1ETTP4991F; RoHS: Compliant; Category: Chip SMD Resistors; Stock: 158433; Pricing: 1=0.1, 10=0.027, 25=0.0196, 50=0.0158, 100=0.0129, 250=0.01004, 500=0.0084, 1000=0.00713, 5000=0.00544 (USD); Case/Package: 0402; Case Code (Imperial): 0402; Case Code (Metric): 1005; China RoHS: Non-Compliant; Composition: Thick Film; Depth: 500µm; Height: 350µm; Lead Free: Lead Free; Length: 1mm; Lifecycle Status: Production; Max Operating Temperature: 155°C; Military Standard: Not; Min Operating Temperature: -55°C; Mounting Technology: Surface Mount; Number of Terminals: 2; REACH SVHC: Yes; Schedule B: 8533210045, 8533210045|8533210045|8533210045|8533210045|8533210045|8533210045|8533210045|8533210045|8533210045|8533210045|8533210045|8533210045|8533210045|8533210045|8533210045|8533210045|8533210045|8533210045|8533210045|8533210045|8533210045|8533210045|8533210045|85; Termination: SMD/SMT; Tolerance: 1%; Voltage Rating (DC): 50V; Width: 500µm; ComponentLink1URL: https://datasheet.octopart.com:443/RK73H1ETTP4991F-KOA-Speer-datasheet-181956035.pdf?src-supplier=IHS; ComponentLink1Description: https://datasheet.octopart.com:443/RK73H1ETTP4991F-KOA-Speer-datasheet-181956035.pdf?src-supplier=IHS; ComponentLink2URL: https://datasheet.octopart.com:443/RK73H1ETTP4991F-KOA-Speer-datasheet-11590619.pdf?src-supplier=Upverter; ComponentLink2Description: https://datasheet.octopart.com:443/RK73H1ETTP4991F-KOA-Speer-datasheet-11590619.pdf?src-supplier=Upverter; ComponentLink3URL: https://datasheet.octopart.com:443/RK73H1ETTP4991F-KOA-Speer-datasheet-188906116.pdf?src-supplier=TME; ComponentLink3Description: https://datasheet.octopart.com:443/RK73H1ETTP4991F-KOA-Speer-datasheet-188906116.pdf?src-supplier=TME; ComponentLink4URL: https://datasheet.octopart.com:443/RK73H1ETTP4991F-KOA-Speer-datasheet-149653815.pdf?src-supplier=Newark; ComponentLink4Description: https://datasheet.octopart.com:443/RK73H1ETTP4991F-KOA-Speer-datasheet-149653815.pdf?src-supplier=Newark; ComponentLink5URL: https://datasheet.octopart.com:443/RK73H1ETTP4991F-KOA-Speer-datasheet-155997623.pdf?src-supplier=Future+Electronics; ComponentLink5Description: https://datasheet.octopart.com:443/RK73H1ETTP4991F-KOA-Speer-datasheet-155997623.pdf?src-supplier=Future+Electronics; ComponentLink6URL: https://datasheet.octopart.com:443/RK73H1ETTP4991F-KOA-Speer-datasheet-11541643.pdf?src-supplier=Arrow+Electronics; ComponentLink6Description: https://datasheet.octopart.com:443/RK73H1ETTP4991F-KOA-Speer-datasheet-11541643.pdf?src-supplier=Arrow+Electronics; ComponentLink7URL: https://datasheet.octopart.com:443/RK73H1ETTP4991F-KOA-Speer-datasheet-5377299.pdf?src-supplier=Garrett; ComponentLink7Description: https://datasheet.octopart.com:443/RK73H1ETTP4991F-KOA-Speer-datasheet-5377299.pdf?src-supplier=Garrett; ComponentLink8URL: https://datasheet.octopart.com:443/RK73H1ETTP4991F-KOA-Speer-datasheet-148194.pdf?src-supplier=Garrett; ComponentLink8Description: https://datasheet.octopart.com:443/RK73H1ETTP4991F-KOA-Speer-datasheet-148194.pdf?src-supplier=Garrett; ComponentLink9URL: https://datasheet.octopart.com:443/RK73H1ETTP4991F-KOA-Speer-datasheet-109211.pdf?src-supplier=Garrett; ComponentLink9Description: https://datasheet.octopart.com:443/RK73H1ETTP4991F-KOA-Speer-datasheet-109211.pdf?src-supplier=Garrett; ComponentLink10URL: http://sigma.octopart.com:80/rohs_statement/KOA-Speer-company-17.pdf?src-supplier=Compliance+Statements; ComponentLink10Description: http://sigma.octopart.com:80/rohs_statement/KOA-Speer-company-17.pdf?src-supplier=Compliance+Statements
R6 = RK73H1ETTP6651F: Res Thick Film 0402 6.65K Ohm 1% 0.1W(1/10W) ±100ppm/C Pad SMD Automotive T/R; Manufacturer: KOA Speer; Power Dissipation: 100mW; Power Rating: 63mW; Value: 6.65kΩ; Temperature Coefficient: 100ppm/°C; Voltage Rating: 50V; Working Voltage: 75V; Supplier: DigiKey; Supplier Part Number: 2019-RK73H1ETTP6651FCT-ND; Manufacturer Part Number: RK73H1ETTP6651F; RoHS: Compliant; Category: Chip SMD Resistors; Stock: 51623; Pricing: 1=0.1, 10=0.027, 25=0.0196, 50=0.0158, 100=0.0129, 250=0.01004, 500=0.0084, 1000=0.00713, 5000=0.00544 (USD); Case/Package: 0402; Case Code (Imperial): 0402; Case Code (Metric): 1005; China RoHS: Non-Compliant; Composition: Thick Film; Depth: 500µm; Height: 350µm; Lead Free: Lead Free; Length: 1mm; Lifecycle Status: Production; Max Operating Temperature: 155°C; Military Standard: Not; Min Operating Temperature: -55°C; Mounting Technology: Surface Mount; Number of Terminals: 2; REACH SVHC: Yes; Schedule B: 8533210045, 8533210045|8533210045|8533210045|8533210045|8533210045|8533210045|8533210045|8533210045|8533210045|8533210045|8533210045|8533210045|8533210045|8533210045|8533210045|8533210045|8533210045|8533210045|8533210045|8533210045|8533210045|8533210045|8533210045|85; Termination: SMD/SMT; Tolerance: 1%; Voltage Rating (DC): 50V; Width: 500µm; ComponentLink1URL: https://datasheet.octopart.com:443/RK73H1ETTP6651F-KOA-Speer-datasheet-181956035.pdf?src-supplier=IHS; ComponentLink1Description: https://datasheet.octopart.com:443/RK73H1ETTP6651F-KOA-Speer-datasheet-181956035.pdf?src-supplier=IHS; ComponentLink2URL: https://datasheet.octopart.com:443/RK73H1ETTP6651F-KOA-Speer-datasheet-11590619.pdf?src-supplier=Upverter; ComponentLink2Description: https://datasheet.octopart.com:443/RK73H1ETTP6651F-KOA-Speer-datasheet-11590619.pdf?src-supplier=Upverter; ComponentLink3URL: https://datasheet.octopart.com:443/RK73H1ETTP6651F-KOA-Speer-datasheet-149653815.pdf?src-supplier=Newark; ComponentLink3Description: https://datasheet.octopart.com:443/RK73H1ETTP6651F-KOA-Speer-datasheet-149653815.pdf?src-supplier=Newark; ComponentLink4URL: https://datasheet.octopart.com:443/RK73H1ETTP6651F-KOA-Speer-datasheet-155997623.pdf?src-supplier=Future+Electronics; ComponentLink4Description: https://datasheet.octopart.com:443/RK73H1ETTP6651F-KOA-Speer-datasheet-155997623.pdf?src-supplier=Future+Electronics; ComponentLink5URL: https://datasheet.octopart.com:443/RK73H1ETTP6651F-KOA-Speer-datasheet-5377299.pdf?src-supplier=Garrett; ComponentLink5Description: https://datasheet.octopart.com:443/RK73H1ETTP6651F-KOA-Speer-datasheet-5377299.pdf?src-supplier=Garrett; ComponentLink6URL: https://datasheet.octopart.com:443/RK73H1ETTP6651F-KOA-Speer-datasheet-148194.pdf?src-supplier=Garrett; ComponentLink6Description: https://datasheet.octopart.com:443/RK73H1ETTP6651F-KOA-Speer-datasheet-148194.pdf?src-supplier=Garrett; ComponentLink7URL: https://datasheet.octopart.com:443/RK73H1ETTP6651F-KOA-Speer-datasheet-109211.pdf?src-supplier=Garrett; ComponentLink7Description: https://datasheet.octopart.com:443/RK73H1ETTP6651F-KOA-Speer-datasheet-109211.pdf?src-supplier=Garrett; ComponentLink8URL: http://sigma.octopart.com:80/rohs_statement/KOA-Speer-company-17.pdf?src-supplier=Compliance+Statements; ComponentLink8Description: http://sigma.octopart.com:80/rohs_statement/KOA-Speer-company-17.pdf?src-supplier=Compliance+Statements

## Nets that join several sheets
GND: IdealDiodeMain (17 pins), U_Buck (20 pins), U_Buck (20 pins)
VIN: IdealDiodeMain (J3.1 J3.2 J4.1 J4.2), U_Buck (8 pins), U_Buck (8 pins)
VOUT: IdealDiodeMain (6 pins), U_Buck (10 pins)
VOUT: IdealDiodeMain (6 pins), U_Buck (10 pins)